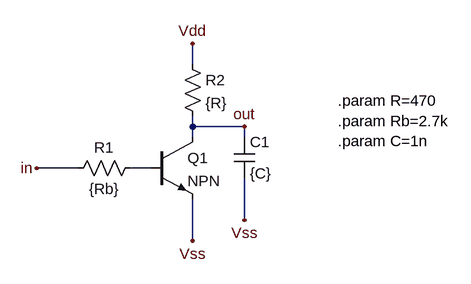
[diagram p0: schematic not.asc]
not.asc, the LTspice schematic file:
Version 4
SHEET 1 880 680
WIRE -96 -240 -96 -272
WIRE -96 -144 -96 -160
WIRE -16 -144 -96 -144
WIRE -96 -128 -96 -144
WIRE -16 -128 -16 -144
WIRE -272 -80 -336 -80
WIRE -160 -80 -192 -80
WIRE -16 0 -16 -64
WIRE -96 32 -96 -32
FLAG -16 -144 out
FLAG -336 -80 in
FLAG -96 32 Vss
FLAG -96 -272 Vdd
FLAG -16 0 Vss
SYMBOL npn -160 -128 R0
SYMATTR InstName Q1
SYMBOL res -176 -96 R90
WINDOW 0 0 56 VBottom 2
WINDOW 3 32 56 VTop 2
SYMATTR InstName R1
SYMATTR Value {Rb}
SYMBOL res -112 -256 R0
SYMATTR InstName R2
SYMATTR Value {R}
SYMBOL cap -32 -128 R0
SYMATTR InstName C1
SYMATTR Value {C}
TEXT 128 -184 Left 2 !.param R=470\n.param Rb=2.7k\n.param C=1n

The netlist it stands for:
* not.asc
Q1 out N001 Vss 0 NPN
R1 N001 in {Rb}
R2 Vdd out {R}
C1 out Vss {C}
.model NPN NPN
.model PNP PNP
.lib standard.bjt
.param R=470
.param Rb=2.7k
.param C=1n
.backanno
.end